# Altium project Legendre Orden 5.PrjPCB
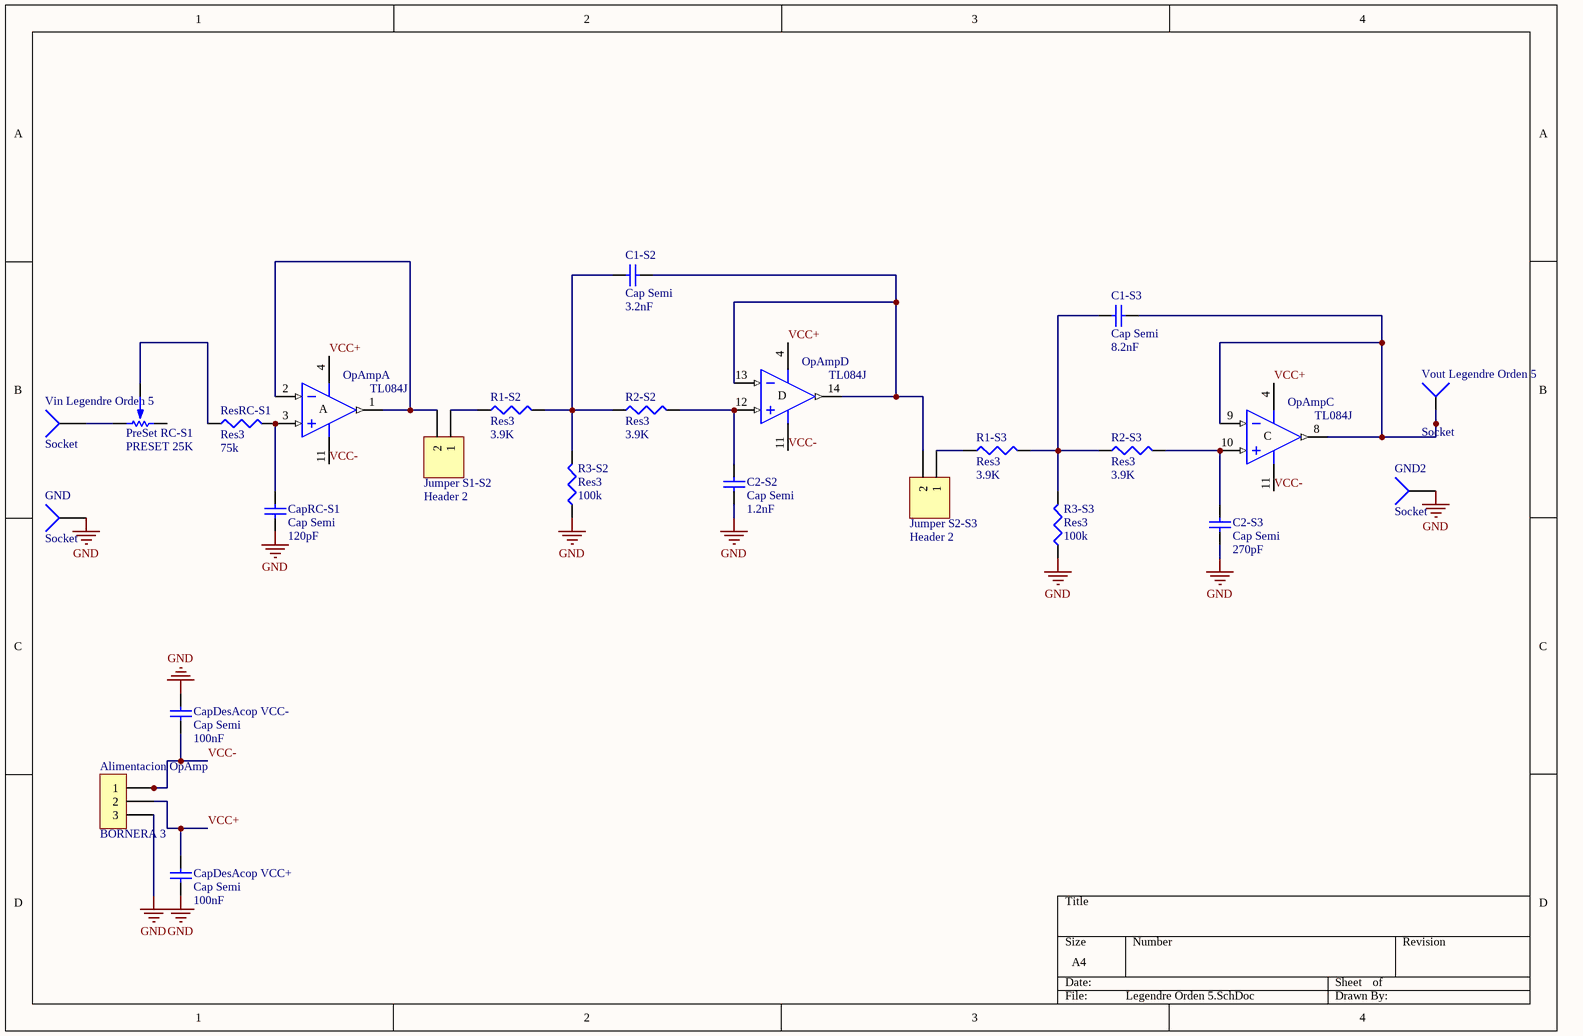
[diagram p0: Legendre Orden 5.SchDoc]
1 sheet, 23 parts. Net scope: global (net labels, ports and power ports of the same name join across sheets).

## Sheet Legendre Orden 5.SchDoc
size A4

### Parts
Alimentacion_OpAmp  BORNERA 3  [BORNERA3]
C1-S2  Cap Semi  value 3.2nF  [C0805]
C1-S3  Cap Semi  value 8.2nF  [C0805]
C2-S2  Cap Semi  value 1.2nF  [C0805]
C2-S3  Cap Semi  value 270pF  [C0805]
CapDesAcop_VCC+  Cap Semi  value 100nF  [C0805]
CapDesAcop_VCC-  Cap Semi  value 100nF  [C0805]
CapRC-S1  Cap Semi  value 120pF  [C0805]
GND  Socket  [PIN1]
GND2  Socket  [PIN1]
Jumper_S1-S2  Header 2  [HDR1X2]
Jumper_S2-S3  Header 2  [HDR1X2]
OpAmp  TL084J  [J014]  (parts A,C,D of 4)
PreSet_RC-S1  PRESET 25K  [PRESET V]
R1-S2  Res3  value 3.9K  [6-0805_M]
R1-S3  Res3  value 3.9K  [6-0805_M]
R2-S2  Res3  value 3.9K  [6-0805_M]
R2-S3  Res3  value 3.9K  [6-0805_M]
R3-S2  Res3  value 100k  [6-0805_M]
R3-S3  Res3  value 100k  [6-0805_M]
ResRC-S1  Res3  value 75k  [6-0805_M]
Vin_Legendre_Orden_5  Socket  [PIN1]
Vout_Legendre_Orden_5  Socket  [PIN1]

### Nets
GND: Alimentacion_OpAmp.3 C2-S2.1 C2-S3.1 CapDesAcop_VCC+.1 CapDesAcop_VCC-.1 CapRC-S1.1 GND.1 GND2.1 R3-S2.1 R3-S3.1
VCC+: Alimentacion_OpAmp.2 CapDesAcop_VCC+.2 OpAmp.4(V+)
VCC-: Alimentacion_OpAmp.1 CapDesAcop_VCC-.2 OpAmp.11(V-)
NetC1-S2_1: C1-S2.1 Jumper_S2-S3.2 OpAmp.13(IN-) OpAmp.14(OUT)
NetC1-S2_2: C1-S2.2 R1-S2.2 R2-S2.1 R3-S2.2
NetC1-S3_1: C1-S3.1 OpAmp.8(OUT) OpAmp.9(IN-) Vout_Legendre_Orden_5.1
NetC1-S3_2: C1-S3.2 R1-S3.2 R2-S3.1 R3-S3.2
NetC2-S2_2: C2-S2.2 OpAmp.12(IN+) R2-S2.2
NetC2-S3_2: C2-S3.2 OpAmp.10(IN+) R2-S3.2
NetCapRC-S1_2: CapRC-S1.2 OpAmp.3(IN+) ResRC-S1.2
NetJumper_S1-S2_1: Jumper_S1-S2.1 R1-S2.1
NetJumper_S1-S2_2: Jumper_S1-S2.2 OpAmp.1(OUT) OpAmp.2(IN-)
NetJumper_S2-S3_1: Jumper_S2-S3.1 R1-S3.1
NetPreSet_RC-S1_1: PreSet_RC-S1.1 Vin_Legendre_Orden_5.1
NetPreSet_RC-S1_2: PreSet_RC-S1.2 ResRC-S1.1

Not connected (* = marked no-connect by the designer): PreSet_RC-S1 3

### Notes on the sheet
- (in symbol TL084J, part A) A
- (in symbol TL084J, part C) C
- (in symbol TL084J, part D) D

### Library data of the parts
C1-S2 C1-S3 C2-S2 C2-S3 CapDesAcop_VCC+ CapDesAcop_VCC- CapRC-S1 = Cap Semi: Capacitor (Semiconductor SIM Model); Published: 8-Jun-2000; LatestRevisionDate: 29-May-2009; LatestRevisionNote: IPC-7351 Footprint Added.; PackageReference: C1206; Publisher: Altium Limited; PackageDescription: Chip Capacitor
Jumper_S1-S2 Jumper_S2-S3 = Header 2: Header, 2-Pin; LatestRevisionDate: 17-Jul-2002; LatestRevisionNote: Re-released for DXP Platform.; Publisher: Altium Limited
OpAmp = TL084J: JFET-Input Operational Amplifier; Published: 16-Jan-2001; LatestRevisionDate: 04-Mar-2005; LatestRevisionNote: Stylized 3D Model Added.; DatasheetVersion: Feb-1999; PackageVersion: Jun-1999; PackageReference: J014; Publisher: Altium Limited; PackageDescription: DIP; 14 Leads; Row Spacing 7.62 mm; Pitch 2.54 mm; ComponentLink1Description: Manufacturer Link; ComponentLink1URL: http://www.ti.com/; ComponentLink2Description: Datasheet; ComponentLink2URL: http://www-s.ti.com/sc/ds/tl084.pdf
PreSet_RC-S1 = PRESET
R1-S2 R1-S3 R2-S2 R2-S3 R3-S2 R3-S3 ResRC-S1 = Res3: Resistor; Published: 8-Jun-2000; LatestRevisionDate: 29-May-2009; LatestRevisionNote: IPC-7351 Footprint Added.; PackageReference: J1-0603; Publisher: Altium Limited; PackageDescription: Chip Resistor
GND GND2 Vin_Legendre_Orden_5 Vout_Legendre_Orden_5 = Socket: LatestRevisionDate: 17-Jul-2002; LatestRevisionNote: Re-released for DXP Platform.; Publisher: Altium Limited